# EAGLE schematic iupitter_v0.95_rev6_161019 (EAGLE 7.7.0)
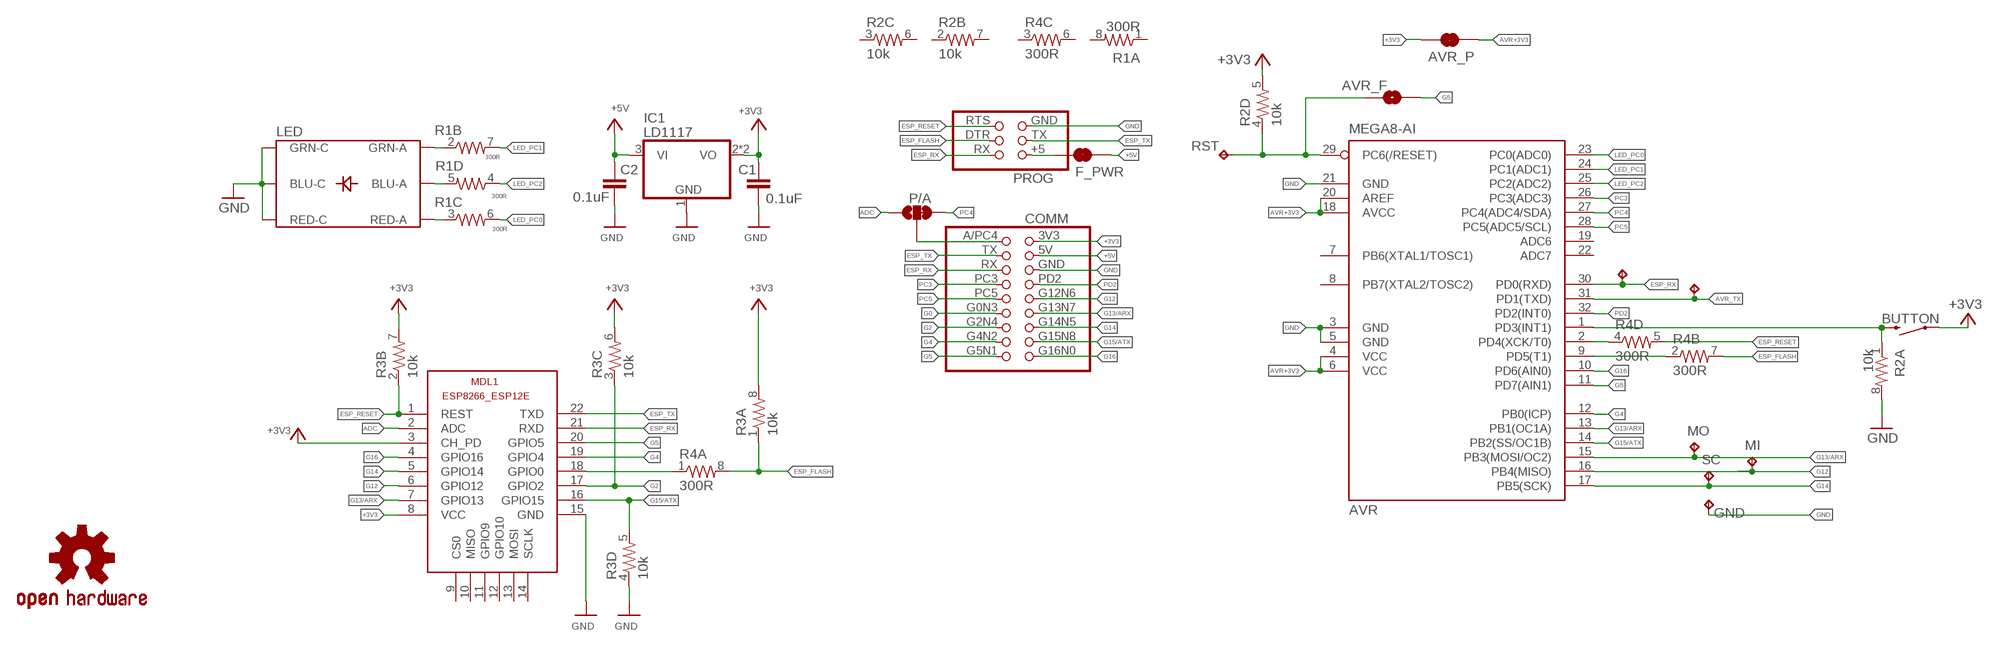
[diagram p0: schematic, sheet 1]

## Parts
ARX  TPTP10SQ  [TP10SQ]
ATX  TPTP10SQ  [TP10SQ]
AVR  MEGA8-AI  [TQFP32-08]
AVR_F  JUMPER-PAD-2-NOYES_SILK  [PAD-JUMPER-2-NO_YES_SILK]
AVR_P  JUMPER-PAD-2-NC_BY_TRACE  [PAD-JUMPER-2-NC_BY_TRACE_YES_SILK]
BUTTON  IT-1181A  SWITCH-MOMENTARY-2SMD-1101NE  [TACTILE-SWITCH-1101NE]
C1  0.1uF  C-EUC1206  [C1206]
C2  0.1uF  C-EUC1206  [C1206]
COMM  COMM_V2RIGHT  [COMM_V2_R(MAIN)]
F_PWR  JUMPER-PAD-2-NC_BY_TRACE  [PAD-JUMPER-2-NC_BY_TRACE_YES_SILK]
GND  TPTP10SQ  [TP10SQ]
IC1  LD1117  [SOT223]
LED  LED-TRICOLOR-5050NO_IC  [LED-TRICOLOR-5050]
LOGO1  OSHW-LOGOS-COPPER  [OSHW-LOGO-S_COPPER]
MDL1  ESP8266-12EESP8266-ESP12E  [ESP8266-ESP12E]
MI  TPTP10SQ  [TP10SQ]
MO  TPTP10SQ  [TP10SQ]
P/A  JUMPER-PAD-3-2OF3_NC_BY_TRACE_SMALL  [PAD-JUMPER-3-2OF3_NC_BY_TRACE_YES_SILK_FULL_BOX]
PROG  FLASH  [FLASH]
R1  300R  RESISTOR-ARRAY0603-ARV  [0603-ARV]
R2  10k  RESISTOR-ARRAY0603-ARV  [0603-ARV]
R3  10k  RESISTOR-ARRAY0603-ARV  [0603-ARV]
R4  300R  RESISTOR-ARRAY0603-ARV  [0603-ARV]
RST  TPTP10SQ  [TP10SQ]
SC  TPTP10SQ  [TP10SQ]

## Nets
+3V3: AVR_P.1 BUTTON.1 C1.1 COMM.3V3(+3V3) IC1.2(VO) IC1.4(VO) MDL1.3(CH_PD) MDL1.8(VCC) R2.5 R3.6 R3.7 R3.8
+5V: C2.1 COMM.5V(+5) F_PWR.2 IC1.3(VI)
ADC: MDL1.2(ADC) P/A.1
AVR+3V3: AVR.4(VCC) AVR.6(VCC) AVR.18(AVCC) AVR.20(AREF) AVR_P.2
AVR_RESET: AVR.29(PC6(/RESET)) AVR_F.1 R2.4 RST.TP
AVR_TX: ATX.TP AVR.31(PD1(TXD))
BLUE_LED: LED.1(BLU-A) R1.5
ESP_FLASH: PROG.DTR R3.1 R4.7 R4.8
ESP_RESET: MDL1.1(REST) PROG.RTS R3.2 R4.5
ESP_RX: ARX.TP AVR.30(PD0(RXD)) COMM.RX MDL1.21(RXD) PROG.RX
ESP_TX: COMM.TX MDL1.22(TXD) PROG.TX
F+5V: F_PWR.1 PROG.+5
G0: COMM.G0N3 MDL1.18(GPIO0) R4.1
G2: COMM.G2N4 MDL1.17(GPIO2) R3.3
G4: AVR.12(PB0(ICP)) COMM.G4N2 MDL1.19(GPIO4)
G5: AVR.11(PD7(AIN1)) AVR_F.2 COMM.G5N1 MDL1.20(GPIO5)
G12: AVR.16(PB4(MISO)) COMM.G12N6 MDL1.6(GPIO12) MI.TP
G13/ARX: AVR.13(PB1(OC1A)) AVR.15(PB3(MOSI/OC2)) COMM.G13N7 MDL1.7(GPIO13) MO.TP
G14: AVR.17(PB5(SCK)) COMM.G14N5 MDL1.5(GPIO14) SC.TP
G15/ATX: AVR.14(PB2(SS/OC1B)) COMM.G15N8 MDL1.16(GPIO15) R3.5
G16: AVR.10(PD6(AIN0)) COMM.G16N0 MDL1.4(GPIO16)
GND: AVR.3(GND) AVR.5(GND) AVR.21(GND) C1.2 C2.2 COMM.GND GND.TP IC1.1(GND) LED.4(GRN-C) LED.5(RED-C) LED.6(BLU-C) MDL1.15(GND) PROG.GND R2.8 R3.4
GREEN_LED: LED.3(GRN-A) R1.2
LED_PC0: AVR.23(PC0(ADC0)) R1.6
LED_PC1: AVR.24(PC1(ADC1)) R1.7
LED_PC2: AVR.25(PC2(ADC2)) R1.4
N$1: COMM.A/PC4(ADC_PC4) P/A.2
PC3: AVR.26(PC3(ADC3)) COMM.PC3
PC4: AVR.27(PC4(ADC4/SDA)) P/A.3
PC5: AVR.28(PC5(ADC5/SCL)) COMM.PC5(PC4)
PD2: AVR.32(PD2(INT0)) COMM.PD2
PD3: AVR.1(PD3(INT1)) BUTTON.2 R2.1
PD4: AVR.2(PD4(XCK/T0)) R4.4
PD5: AVR.9(PD5(T1)) R4.2
RED_LED: LED.2(RED-A) R1.3
Unconnected: AVR.7(PB6(XTAL1/TOSC1)) AVR.8(PB7(XTAL2/TOSC2)) AVR.19(ADC6) AVR.22(ADC7) MDL1.9(CS0) MDL1.10(MISO) MDL1.11(GPIO9) MDL1.12(GPIO10) MDL1.13(MOSI) MDL1.14(SCLK) R1.1 R1.8 R2.2 R2.3 R2.6 R2.7 R4.3 R4.6

## Library data of the parts
ARX ATX GND MI MO RST SC = testpad_new:TP: Test pad
AVR = atmel:MEGA8: MICROCONTROLLER 8 Kbytes FLASH, 1 kbytes SRAM, 512 bytes EEPROM, USART, 6-channel 10 bit ADC, 2-channel 8 bit ADC Pin compatible with Atmega48, ATMega88, ATMega168 Source: avr.lbr; MPN: ATMEGA8-16AU; OC_FARNELL: 9171371; OC_NEWARK: 73M8863
AVR_F = SparkFun-Passives:JUMPER-PAD-2-NO
AVR_P F_PWR = SparkFun-Passives:JUMPER-PAD-2-NC_BY_TRACE
BUTTON = SparkFun-Electromechanical:SWITCH-MOMENTARY-2: Various NO switches- pushbuttons, reed, etc; PROD_ID: SWCH-00815
C1 C2 = rcl:C-EU: CAPACITOR, European symbol
COMM = ESP12:COMM_V2: Iupitter comm socket 2.54 mm
IC1 = voltagereg:LD1117: Fixed output low drop voltage regulator
LED = SparkFun-LED:LED-TRICOLOR-5050; PROD_ID: DIO-10298
LOGO1 = SparkFun-Aesthetics:OSHW-LOGO: Open Source Hardware Logo This logo indicates the piece of hardware it is found on incorporates a OSHW license and/or adheres to the definition of open source hardware found here: http://freedomdefined.org/OSHW
MDL1 = ESP12:ESP8266-12E: ESP8266-12E with additional I/O and GPIO04/05 corrected The author cannot warrant that this library is free from error or will meet your specific requirements. Created by PuceBaboon.com. Komagane, Nagano, JAPAN
P/A = SparkFun-Passives:JUMPER-PAD-3-2OF3_NC_BY_TRACE
PROG = ESP12:FLASH: Iupitter flash socket, 2.54 mm
R1-R4 = SparkFun-Resistors:RESISTOR-ARRAY: Array Chip Resistor Source: RS Component / Phycomp